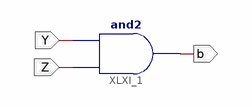
[diagram p0: schematic sheet 1]
// Xilinx ISE schematic circuitoB.sch (spartan3e) as structural Verilog: 1 symbols, 3 ports
module circuitoB (
  input  Y,
  input  Z,
  output b
);

  and XLXI_1 (b, Z, Y);
endmodule
